# Altium schematic sheet FPGA_51_Spirit_Level.SchDoc: LCD Spirit Level Tester
size B; DocumentNumber: 1; SheetNumber: 1; SheetTotal: 1
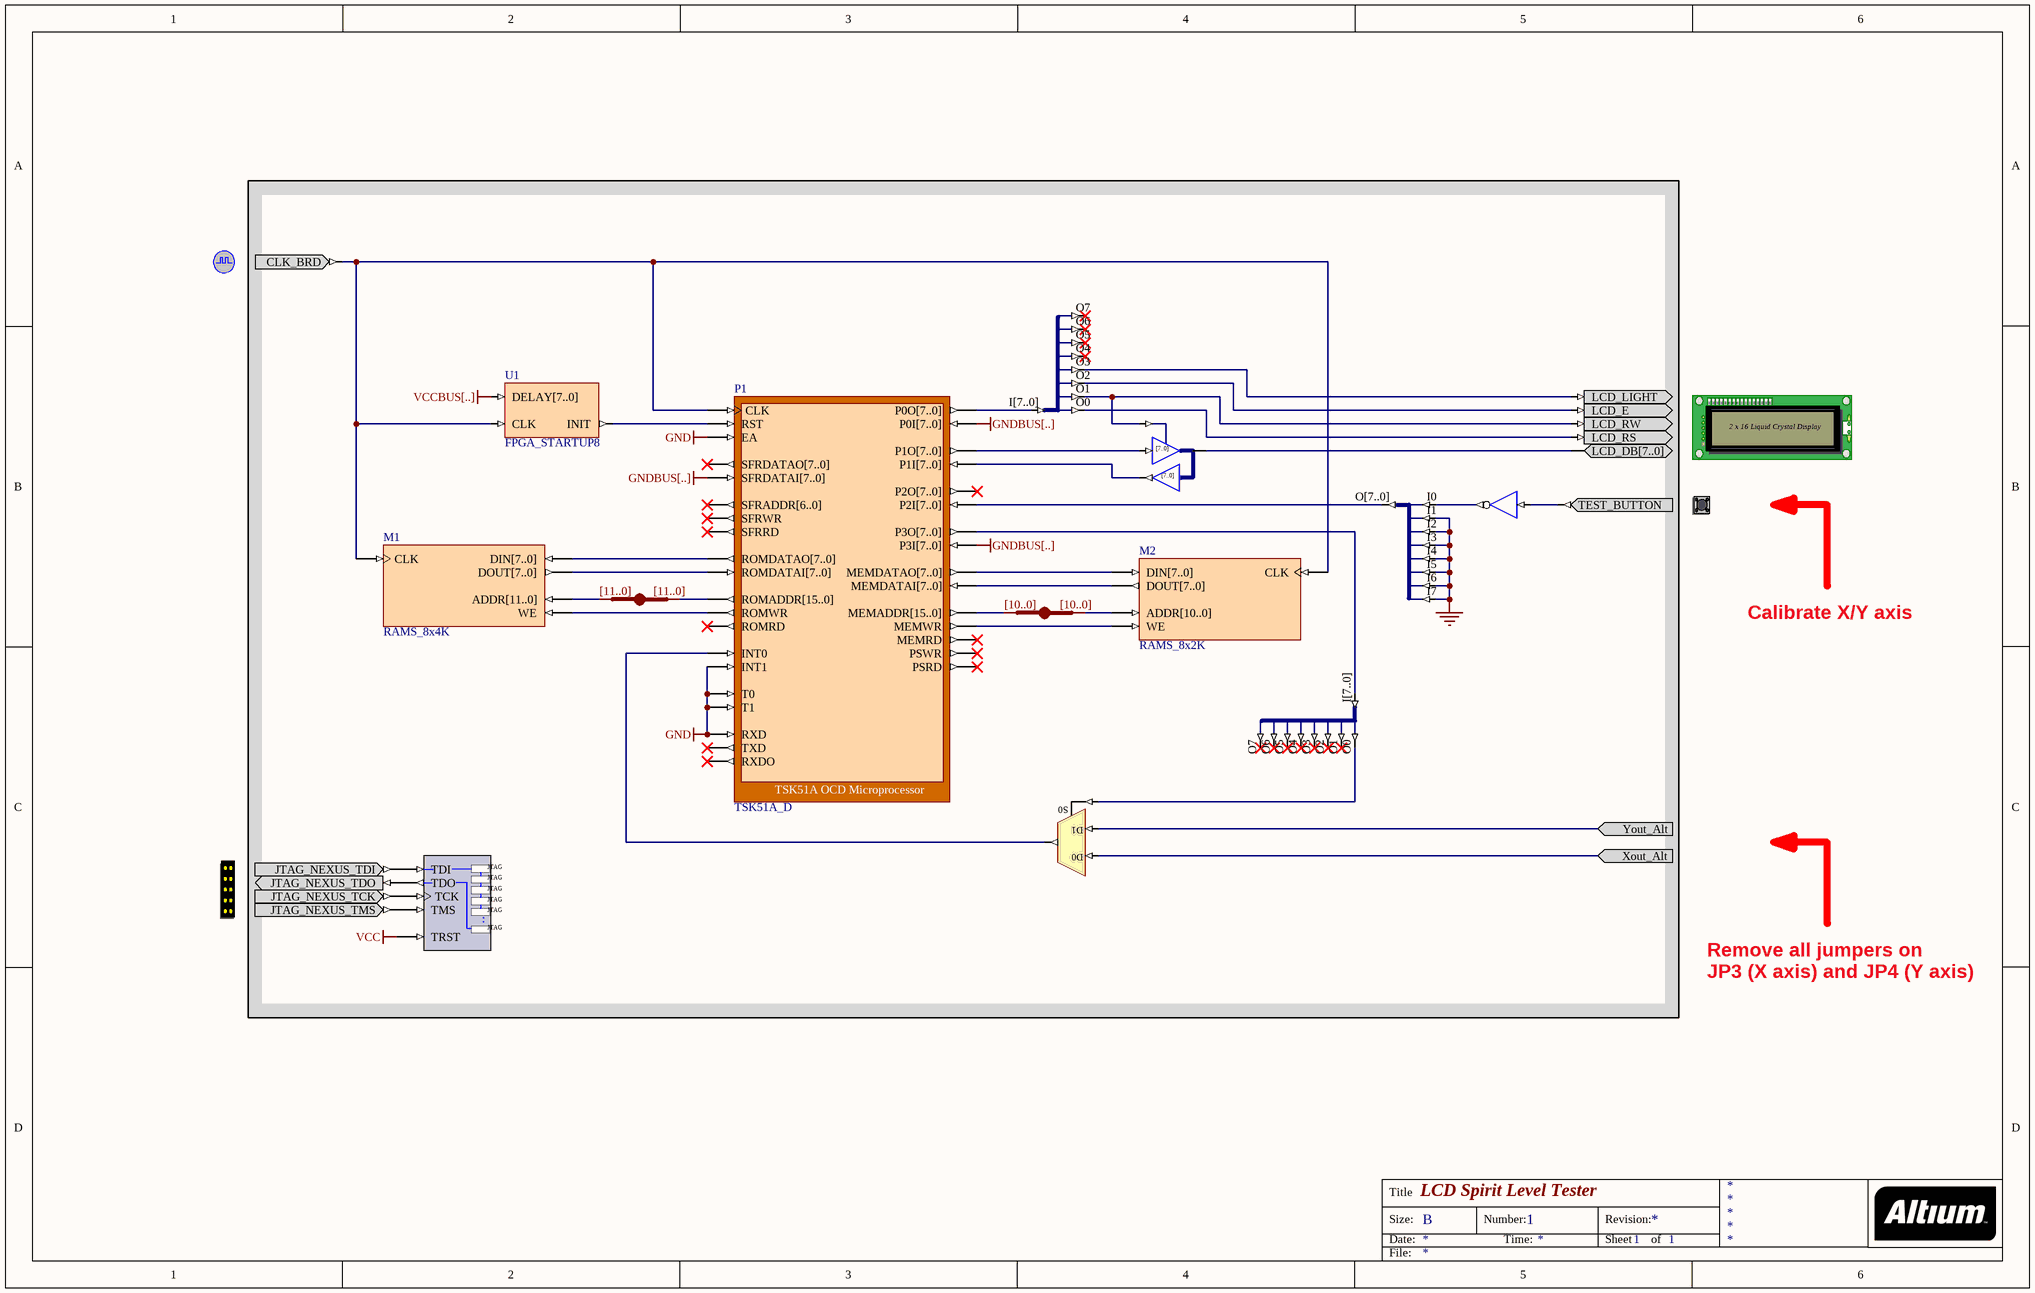
[diagram p0: FPGA_51_Spirit_Level.SchDoc]

## Parts
(Parts that share a designator on the sheet are numbered #1, #2 ... from top to bottom, then left to right.)
?#1  CLOCK_BOARD  (value not drawn)
?#2  LCD  (value not drawn)
?#3  TEST_BUTTON  (value not drawn)
?#4  NEXUS_JTAG_CONNECTOR  (value not drawn)
JB_S1  IndexA: [11..0]  (hidden comment: JB)
JB_S2  IndexA: [10..0]  (hidden comment: JB)
M1  RAMS_8x4K
M2  RAMS_8x2K
NEXUS_JTAG_PORT  NEXUS_JTAG_PORT  (value not drawn)
P1  TSK51A_D
U1  FPGA_STARTUP8
U2  IOBUF8B  (value not drawn)
U3  J8B_8S  (value not drawn)
U4  INV  (value not drawn)
U5  J8S_8B  (value not drawn)
U6  J8B_8S  (value not drawn)
U7  M1_S2S1  (value not drawn)

## Ports
Xout_Alt (in), Yout_Alt (in)

## Nets
GND: P1.EA P1.INT1 P1.RXD P1.T0 P1.T1 U5.I1 U5.I2 U5.I3 U5.I4 U5.I5 U5.I6 U5.I7
GNDBUS[..]: P1.P0I[7..0] P1.P3I[7..0] P1.SFRDATAI[7..0]
VCC: NEXUS_JTAG_PORT.TRST
VCCBUS[..]: U1.DELAY[7..0]
Xout_Alt: U7.D0 ; port Xout_Alt
Yout_Alt: U7.D1 ; port Yout_Alt
Net?#1_CLK_BRD: ?#1.CLK_BRD M1.CLK M2.CLK P1.CLK U1.CLK
Net?#2_LCD_DB[7..0]: ?#2.LCD_DB[7..0] U2.IO[7..0]
Net?#2_LCD_E: ?#2.LCD_E U3.O2
Net?#2_LCD_LIGHT: ?#2.LCD_LIGHT U3.O3
Net?#2_LCD_RS: ?#2.LCD_RS U3.O0
Net?#2_LCD_RW: ?#2.LCD_RW U2.T U3.O1
Net?#3_TEST_BUTTON: ?#3.TEST_BUTTON U4.I
Net?#4_JTAG_NEXUS_TCK: ?#4.JTAG_NEXUS_TCK NEXUS_JTAG_PORT.TCK
Net?#4_JTAG_NEXUS_TDI: ?#4.JTAG_NEXUS_TDI NEXUS_JTAG_PORT.TDI
Net?#4_JTAG_NEXUS_TDO: ?#4.JTAG_NEXUS_TDO NEXUS_JTAG_PORT.TDO
Net?#4_JTAG_NEXUS_TMS: ?#4.JTAG_NEXUS_TMS NEXUS_JTAG_PORT.TMS
NetJB_S1_A[0..0]: JB_S1.A[0..0] M1.ADDR[11..0]
NetJB_S1_B[0..0]: JB_S1.B[0..0] P1.ROMADDR[15..0]
NetJB_S2_A[0..0]: JB_S2.A[0..0] P1.MEMADDR[15..0]
NetJB_S2_B[0..0]: JB_S2.B[0..0] M2.ADDR[10..0]
NetM1_DIN[7..0]: M1.DIN[7..0] P1.ROMDATAO[7..0]
NetM1_DOUT[7..0]: M1.DOUT[7..0] P1.ROMDATAI[7..0]
NetM1_WE: M1.WE P1.ROMWR
NetM2_DIN[7..0]: M2.DIN[7..0] P1.MEMDATAO[7..0]
NetM2_DOUT[7..0]: M2.DOUT[7..0] P1.MEMDATAI[7..0]
NetM2_WE: M2.WE P1.MEMWR
NetP1_INT0: P1.INT0 U7.O
NetP1_P0O[7..0]: P1.P0O[7..0] U3.I[7..0]
NetP1_P1I[7..0]: P1.P1I[7..0] U2.O[7..0]
NetP1_P1O[7..0]: P1.P1O[7..0] U2.I[7..0]
NetP1_P2I[7..0]: P1.P2I[7..0] U5.O[7..0]
NetP1_P3O[7..0]: P1.P3O[7..0] U6.I[7..0]
NetP1_RST: P1.RST U1.INIT
NetU4_O: U4.O U5.I0
NetU6_O0: U6.O0 U7.S0

Not connected (* = marked no-connect by the designer): P1 MEMRD* P2O[7..0]* PSRD* PSWR* ROMRD* RXDO* SFRADDR[6..0]* SFRDATAO[7..0]* SFRRD* SFRWR* TXD*; U3 O4* O5* O6* O7*; U6 O1* O2* O3* O4* O5* O6* O7*

## Notes on the sheet
- Calibrate X/Y axis
- Remove all jumpers on
  JP3 (X axis) and JP4 (Y axis)
- Title
- Size:
- Date:
- B
- Number:
- Time:
- Revision:
- Sheet
- of
- File:
- (in symbol IOBUF8B) [7..0]
- (in symbol LCD) 2 x 16 Liquid Crystal Display
- (in symbol NEXUS_JTAG_PORT) JTAG; .

## Library data of the parts
?#1 = CLOCK_BOARD: Global System Clock Supply; PortComponent: True; Published: 19-Nov-2003; Publisher: Altium Limited
?#2 = LCD: Liquid Crystal Display; PortComponent: True; Published: 19-Nov-2003; Publisher: Altium Limited
?#3 = TEST_BUTTON: Test Button; PortComponent: True; Published: 19-Nov-2003; Publisher: Altium Limited
?#4 = NEXUS_JTAG_CONNECTOR: JTAG Port; PortComponent: True; Published: 19-Nov-2003; Publisher: Altium Limited
JB_S1 JB_S2 = JB: System BUS Joiner; Published: 29-Jan-2004; Publisher: Altium Limited; FunctionalClass: Bus Joiner; HelpURL: CR0118 FPGA Generic Library Guide.pdf#page=296; LastRevisionNo: 1.00.00
  JB_S1: IndexB: [11..0]
  JB_S2: IndexB: [10..0]
M1 = RAMS_8x4K: Single Port RAM; Memory_Depth: 4096; Memory_Type: RAM_SinglePortBlock; Memory_Width: 8; Memory_ClockEdge: Rising; Nexus_Core: Memory_Program; Memory_EnablePin: False; Published: 11/10/2004; Publisher: Altium Hobart Technology Center; Memory_ByteWrites: False
M2 = RAMS_8x2K: Single Port RAM; Memory_Depth: 2048; Memory_Type: RAM_SinglePortBlock; Memory_Width: 8; Memory_ClockEdge: Rising; Nexus_Core: Memory_Program; Memory_EnablePin: False; Published: 11/10/2004; Publisher: Altium Hobart Technology Center; Memory_ByteWrites: False
NEXUS_JTAG_PORT = NEXUS_JTAG_PORT: Soft Nexus-Chain Connector; NEXUS_JTAG_CONNECTOR: True; VHDLIB_SIM: GENERIC_LIB; Published: 29-Jan-2004; Publisher: Altium Limited
P1 = TSK51A_D: TSK51A OCD Microprocessor; NEXUS_CORE: Processor_OCDS; NEXUS_JTAG_DEVICE: True; NEXUS_JTAG_ORDER: 0; ChildModel1: RAM256x8_TSK51D; ChildCore1: M1; Published: 17-Nov-2004; Publisher: Altium Limited; ComponentLink1Description: Core &Resource Usage; ComponentLink1URL: CR0140 FPGA Processor Resource Usage.pdf#page=3; ComponentLink2Description: Embedded &Tools Guide; ComponentLink2URL: GU0107 Using the TSK51x TSK52x Embedded Tools.pdf; ComponentLink3Description: Embedded T&echnical References; ComponentLink3URL: TR0105 TSK51x TSK52x Embedded Tools Reference.pdf; HelpURL: CR0115 TSK51x MCU.pdf#page=3; LastRevisionNo: 1.00.00
U1 = FPGA_STARTUP8: FPGA Startup With 8 Bit Delay; Published: 9-Dec-2004; Publisher: Altium Limited; ComponentLink1Description: Core &Resource Usage; ComponentLink1URL: CR0139 FPGA Peripheral Resource Usage.pdf#page=9; HelpURL: CR0119 FPGA_STARTUPx Powerup Delay Unit.pdf#page=2; LastRevisionNo: 1.00.00
U2 = IOBUF8B: 8-Bit Input/Output Buffer, Bus Version; ArchiveName: GENERIC; VHDLIB_SIM: GENERIC_LIB; Control: Common Control T; Enable: Low; PortSize: 8; SubClass: IOBUF; Published: 29-Jan-2004; Publisher: Altium Limited; ComponentLink1Description: Core &Resource Usage; ComponentLink1URL: CR0125 FPGA Buffer Resource Usage.pdf#page=87; FunctionalClass: Buffer; HelpURL: CR0118 FPGA Generic Library Guide.pdf#page=292; LastRevisionNo: 1.00.00; PortStyle: Bus Version
U3 U6 = J8B_8S: 8-Bit input bus to 8 single pin outputs; ArchiveName: GENERIC; VHDLIB_SIM: GENERIC_LIB; FunctionalClass: Bus Joiner; PortSize: 8; Published: 29-Jan-2004; Publisher: Altium Limited; ComponentLink1Description: Core &Resource Usage; ComponentLink1URL: CR0126 FPGA Bus Joiner Resource Usage.pdf#page=27; HelpURL: CR0118 FPGA Generic Library Guide.pdf#page=303; LastRevisionNo: 1.00.00
U4 = INV: Inverter; FunctionalClass: Logic Primitive; ArchiveName: GENERIC; VHDLIB_SIM: GENERIC_LIB; Published: 29-Jan-2004; Publisher: Altium Limited; XilinxEquivalent: INV; LastRevisionNo: 1.00.00; HelpURL: CR0118 FPGA Generic Library Guide.pdf#page=290; ComponentLink1URL: CR0136 FPGA Logic Primitive Resource Usage.pdf#page=61; ComponentLink1Description: Core &Resource Usage; SubClass: INV
U5 = J8S_8B: 8 Single pin inputs to single 8-Bit output bus; FunctionalClass: Bus Joiner; PortSize: 8; ArchiveName: GENERIC; VHDLIB_SIM: GENERIC_LIB; Published: 29-Jan-2004; Publisher: Altium Limited; LastRevisionNo: 1.00.00; HelpURL: CR0118 FPGA Generic Library Guide.pdf#page=305; ComponentLink1URL: CR0126 FPGA Bus Joiner Resource Usage.pdf#page=28; ComponentLink1Description: Core &Resource Usage
U7 = M1_S2S1: 2x1-Single Wire to 1x1-Single Wire Multiplexer; ArchiveName: GENERIC; VHDLIB_SIM: GENERIC_LIB; PortSize: 1; PortStyle: Single Pin Version; SubClass: SnS1; XilinxEquivalent: M2_1; Published: 29-Jan-2004; Publisher: Altium Limited; ComponentLink1Description: Core &Resource Usage; ComponentLink1URL: CR0137 FPGA Multiplexer Resource Usage.pdf#page=50; FunctionalClass: Multiplexer; HelpURL: CR0118 FPGA Generic Library Guide.pdf#page=358; LastRevisionNo: 1.00.00